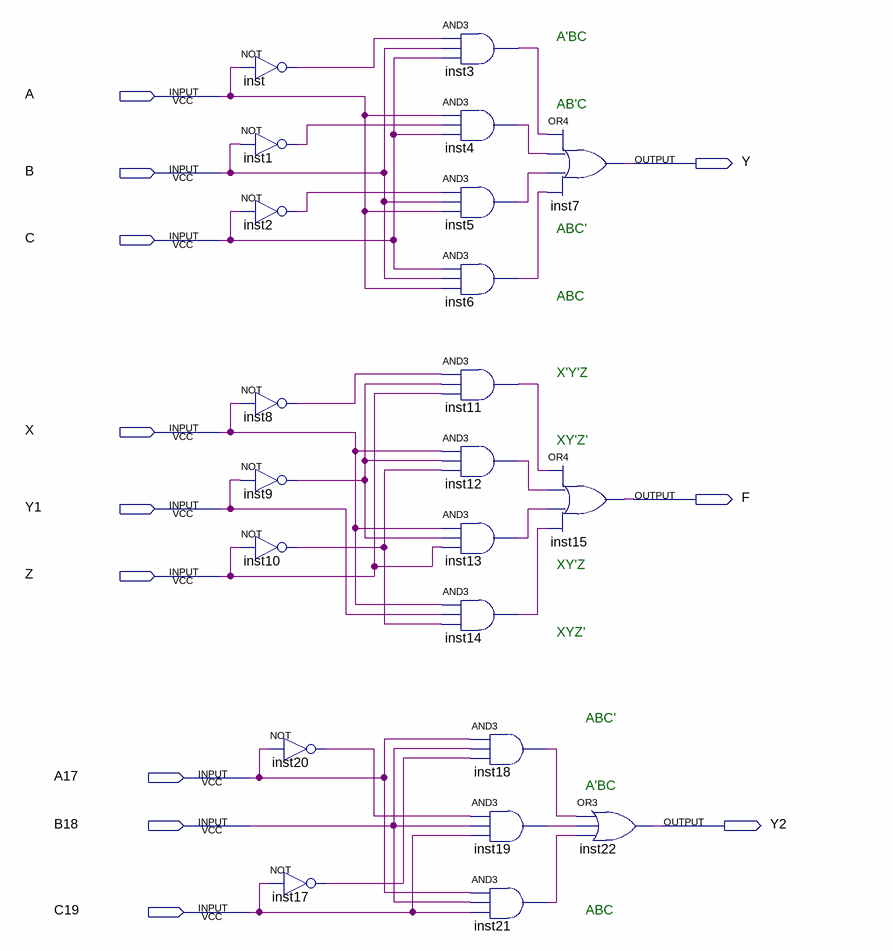
[diagram p0: schematic sheet]
// Quartus schematic voting_circuit_1.bdf as structural Verilog: 22 symbols, 12 pins
module voting_circuit_1 (
  input  A,
  input  B,
  input  C,
  input  X,
  input  Y1,
  input  Z,
  input  A17,
  input  B18,
  input  C19,
  output Y,
  output F,
  output Y2
);

  wire inst1_out, inst2_out, inst3_out, inst4_out, inst5_out, inst6_out, inst8_out, inst9_out, inst10_out,
       inst11_out, inst12_out, inst13_out, inst14_out, inst17_out, inst18_out, inst19_out, inst20_out,
       inst21_out, inst_out;

  not inst (inst_out, A);
  not inst1 (inst1_out, B);
  not inst2 (inst2_out, C);
  not inst8 (inst8_out, X);
  not inst9 (inst9_out, Y1);
  not inst10 (inst10_out, Z);
  not inst20 (inst20_out, A17);
  not inst17 (inst17_out, C19);
  and inst3 (inst3_out, inst_out, B, C);
  and inst4 (inst4_out, A, inst1_out, C);
  and inst5 (inst5_out, inst2_out, B, A);
  and inst6 (inst6_out, C, B, A);
  and inst11 (inst11_out, inst8_out, inst9_out, Z);
  and inst12 (inst12_out, X, inst9_out, inst10_out);
  and inst13 (inst13_out, X, inst9_out, Z);
  and inst14 (inst14_out, X, Y1, inst10_out);
  and inst18 (inst18_out, A17, B18, inst17_out);
  and inst19 (inst19_out, inst20_out, B18, C19);
  and inst21 (inst21_out, A17, B18, C19);
  or inst7 (Y, inst3_out, inst4_out, inst5_out, inst6_out);
  or inst15 (F, inst11_out, inst12_out, inst13_out, inst14_out);
  or inst22 (Y2, inst18_out, inst19_out, inst21_out);

  // Notes on the sheet:
  //   A'BC
  //   AB'C
  //   ABC'
  //   ABC
  //   X'Y'Z
  //   XY'Z'
  //   XY'Z
  //   XYZ'
  //   ABC'
  //   A'BC
  //   ABC
endmodule
